# Altium schematic sheet Sheet1.SchDoc
size A4; SheetNumber: 1; SheetTotal: 1
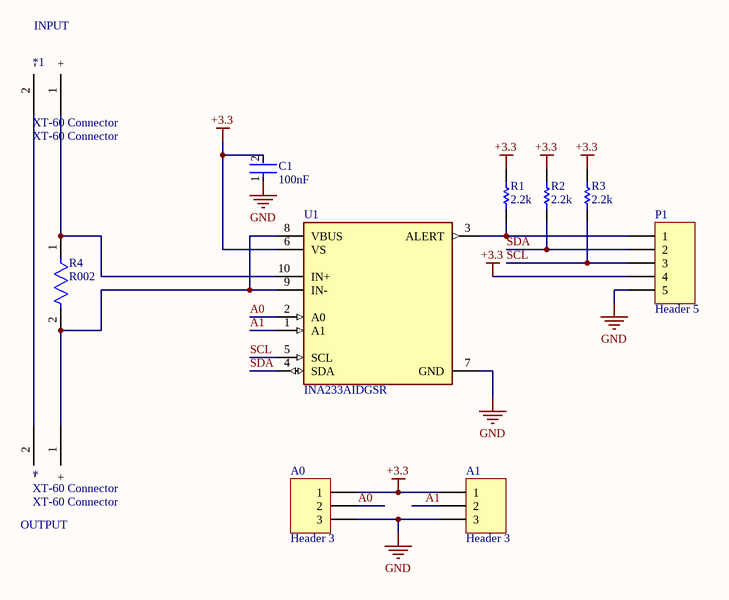
[diagram p0: Sheet1.SchDoc]

## Parts
*  XT-60 Connector  [XT-60]
*1  XT-60 Connector  [XT-60]
A0  Header 3  [HDR1X3]
A1  Header 3  [HDR1X3]
C1  100nF  [FP-0805-L_2_01_0_2-W_1_25-IPC_B]
P1  Header 5  [HDR1X5]
R1  2.2k  [RESC2013X60X35ML10T20]
R2  2.2k  [RESC2013X60X35ML10T20]
R3  2.2k  [RESC2013X60X35ML10T20]
R4  R002  [FP-RL2512-MFG]
U1  INA233AIDGSR  [FP-DGS0010A-MFG]

## Nets
+3.3: A0.1 A1.1 C1.2 P1.4 R1.2 R2.2 R3.2 U1.6(VS)
GND: A0.3 A1.3 C1.1 P1.5 U1.7(GND)
A0: A0.2 U1.2(A0)
A1: A1.2 U1.1(A1)
SCL: P1.3 R3.1 U1.5(SCL)
SDA: P1.2 R2.1 U1.4(SDA)
Net*1_1: *1.1(+) R4.1 U1.10(IN+)
Net*_1: *.1(+) R4.2 U1.8(VBUS) U1.9(IN-)
Net*_2: *.2(-) *1.2(-)
NetP1_1: P1.1 R1.1 U1.3(ALERT)

## Notes on the sheet
- (near *1) INPUT
- OUTPUT

## Library data of the parts
* *1 = XT-60 Connector: Manufacturer: POLOLU; Manufacturer Part Number: XT60 YELLOW; Unit: pcs; SuppliedAmount: 0; MinAmount: 1; Type of robotics accessories: power connector; Maximum current: 65A; Information: Product is not a working device, but only component; Supplier 1: TME; Category: Power Supply Modules; Stock 1: 29; Pricing 1: 1=2.08, 10=1.95 (USD); Weight: 7.267; Multiples: 1; Number of pins: 2; Colour: yellow; Price Type: NET; ComponentLink1URL: http://static.tme.eu/products_pics/8/b/5/8b5040a8a5baf3e0e67386c2e3a9b903/913.jpg; ComponentLink1Description: http://static.tme.eu/products_pics/8/b/5/8b5040a8a5baf3e0e67386c2e3a9b903/913.jpg; Supplier Part Number 1: XT-60 Connector
A0 A1 = Header 3: Header, 3-Pin; LatestRevisionDate: 17-Jul-2002; LatestRevisionNote: Re-released for DXP Platform.; Publisher: Altium Limited
C1 = CMP-2007-04174-2: General Purpose Ceramic Capacitor, 0805, 100nF, 10%, X7R, 15%, 100V; Packaging: Tape and Reel; Min Operating Temperature: -55°C; Dielectric Material: Ceramic; Height: 1.4mm; Voltage Rating: 100V; Termination: SMD/SMT; Case Code (Imperial): 0805; Case Code (Metric): 2012; Case/Package: 0805; Construction: Flat; Radiation Hardening: No; Series: -; Dielectric: X7R; Package Quantity: 2000; Mount: Surface Mount; Capacitance: 100nF; Contact Plating: Tin; Voltage: 100V; Lead Free: Lead Free; Depth: 1.25mm; RoHS Compliant: Yes; Number of Pins: 2; Max Operating Temperature: 125°C; Length: 2.01mm; Voltage Rating (DC): 100V; Thickness: 0.055inch; REACH SVHC: No SVHC; Width: 0.049inch; Tolerance: 10%
P1 = Header 5: Header, 5-Pin; LatestRevisionDate: 17-Jul-2002; LatestRevisionNote: Re-released for DXP Platform.; Publisher: Altium Limited
R1-R3 = CMP-2100-03673-1: Chip Resistor, 0 Ohm, Jumper, +/- 5%, 0.125 W, -55 to 155 degC, 0805 (2012 Metric), RoHS, Tape and Reel; Manufacturer: Yageo; Power Rating: 125mW; Resistance: 0mOhm; Voltage Rating (DC): 150V; Temperature Coefficient: 200ppm/degreesC; Height: 0.5mm; Depth: 1.25mm; Case Code (Imperial): 0805; Lead Free: LeadFree; Military Standard: Not; Package Description: 2-Pin Surface Mounted Device, Body 2 x 1.25 mm; Case Code (Metric): 2012; Composition: ThickFilm; Voltage Rating: 150V; Manufacturer URL: http://www.yageo.com/; Packaging: TapeandReel; Package Reference: 0805; REACH SVHC: Unknown; Tolerance: 5%; Case/Package: 0805; Max Operating Temperature: 155degC; Number of Pins: 2; Min Operating Temperature: -55degC; RoHSCompliant: true; Length: 2mm; Datasheet URL: http://www.yageo.com/NewPortal/yageodocoutput?fileName=/pdf/R-Chip/PYu-RC_Group_51_RoHS_L_5.pdf; Termination: SMD/SMT; Radiation Hardening: No; Width: 1.25mm; Contact Plating: Tin; Datasheet Version: Rev. 5, 10/2016
R4 = CMP-03412-013102-1: RES 0.1 OHM 1% 1W 2512; Manufacturer: YAGEO; Manufacturer Part Number: RL2512FK-070R1L; Automotive Grade: Grade 0; Temperature Coefficient: 600ppm/°C; Description: Thick Film Resistors - SMD 0.1ohm 1% 1W; Value: 100mΩ; Lead Free: Yes; Package: RL2512; Temperature Range High: +155°C; Octopart: https://octopart.com/rl2512fk-070r1l-yageo-42334369; Composition: Thick Film; Height: 0.65mm; ComponentLink2URL: http://www.yageo.com/documents/recent/PYu-RL_Group_521_RoHS_L_2.pdf; Device Class L3: Chip SMD Resistors; Automotive: Yes; Series: RL; Device Class L1: Passive Components; Device Class L2: Resistors; Mouser Description: Current Sense Resistors 0.1ohm 1% 1W; Temperature: -55°C to +155°C; ComponentLink2Description: Datasheet; Footprint Url: http://www.yageo.com/exep/pages/download/literatures/PYu-R_Mount_10.pdf; Ipc Land Pattern Name: RESC635320X55; RoHS: TRUE; Category: Res; Temperature Range Low: -55°C; Power Rating: 1W; Tolerance: 1%; Resistance: 100mΩ; Digikey Description: RES 0.1 OHM 1% 1W 2512
U1 = CMP-04895-000095-1: Output Current: 10mA; Accuracy: 0.1%; Mount: Surface Mount; Case/Package: VSSOP; Min Operating Temperature: -40°C; Max Operating Temperature: 125°C; RoHS Compliant: Yes; Packaging: Tape and Reel